# EAGLE design Gator-Tiara (EAGLE 6.4)
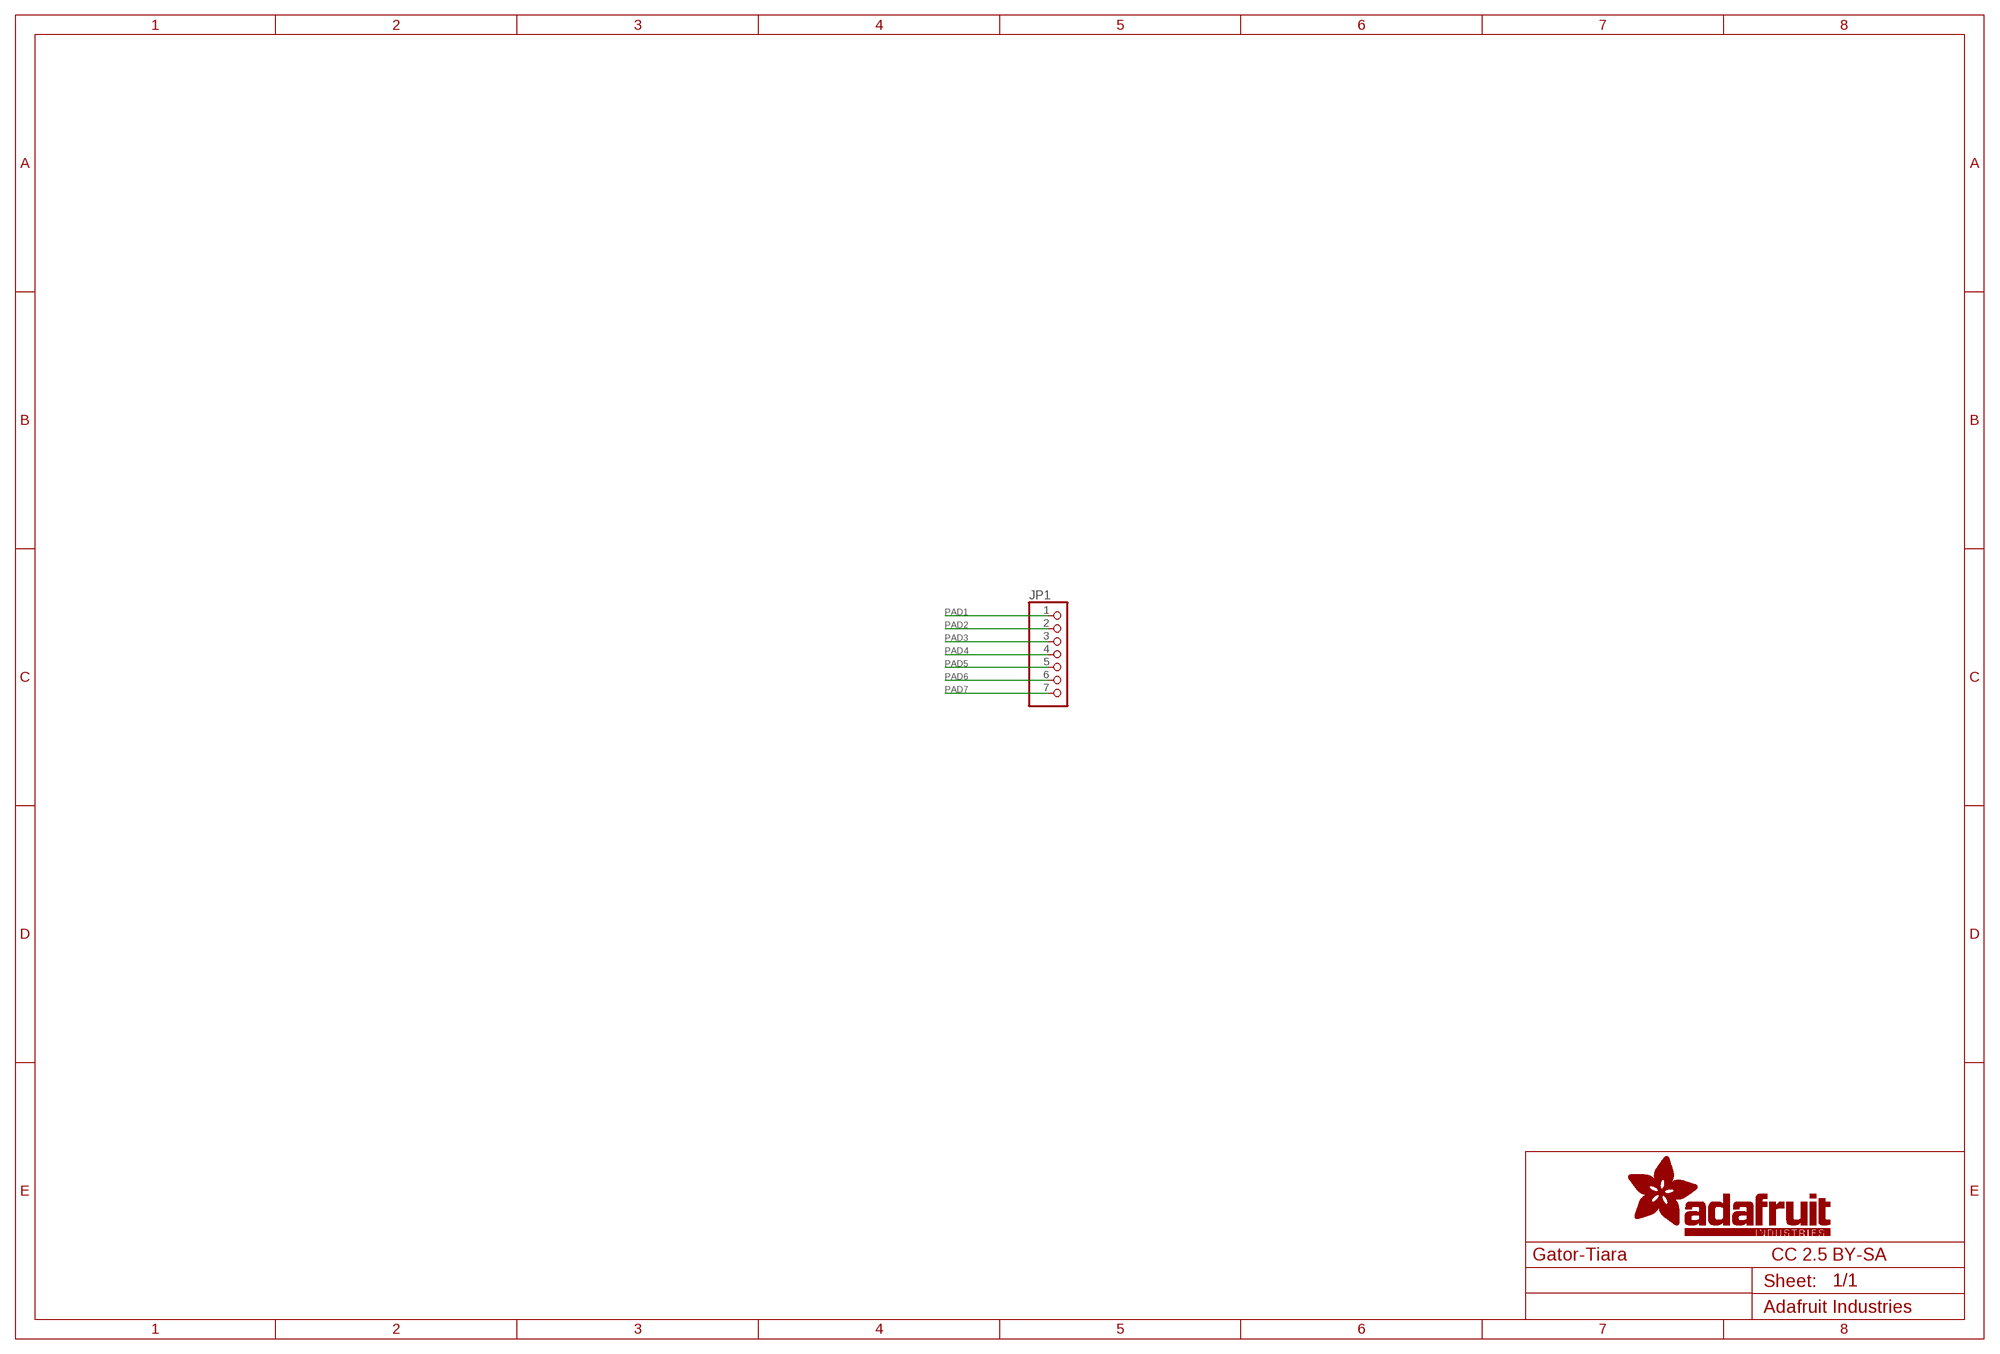
[diagram p0: schematic, sheet 1]

## Parts
JP1  PINHD-1X7/90  [1X07/90]
PAD1  SEWTAP-ALLIGATOR  [SEWALLI]
PAD2  SEWTAP-ALLIGATOR  [SEWALLI]
PAD3  SEWTAP-ALLIGATOR  [SEWALLI]
PAD4  SEWTAP-ALLIGATOR  [SEWALLI]
PAD5  SEWTAP-ALLIGATOR  [SEWALLI]
PAD6  SEWTAP-ALLIGATOR  [SEWALLI]
PAD7  SEWTAP-ALLIGATOR  [SEWALLI]

## Nets
N$1: JP1.1 PAD1.P$1(SEW)
N$2: JP1.2 PAD2.P$1(SEW)
N$3: JP1.3 PAD3.P$1(SEW)
N$4: JP1.4 PAD4.P$1(SEW)
N$5: JP1.5 PAD5.P$1(SEW)
N$6: JP1.6 PAD6.P$1(SEW)
N$7: JP1.7 PAD7.P$1(SEW)

## Notes on the sheet
- CC 2.5 BY-SA

## Library data of the parts
JP1 = pinhead:PINHD-1X7: PIN HEADER
PAD1-PAD7 = microbuilder:SEWTAP

## Board
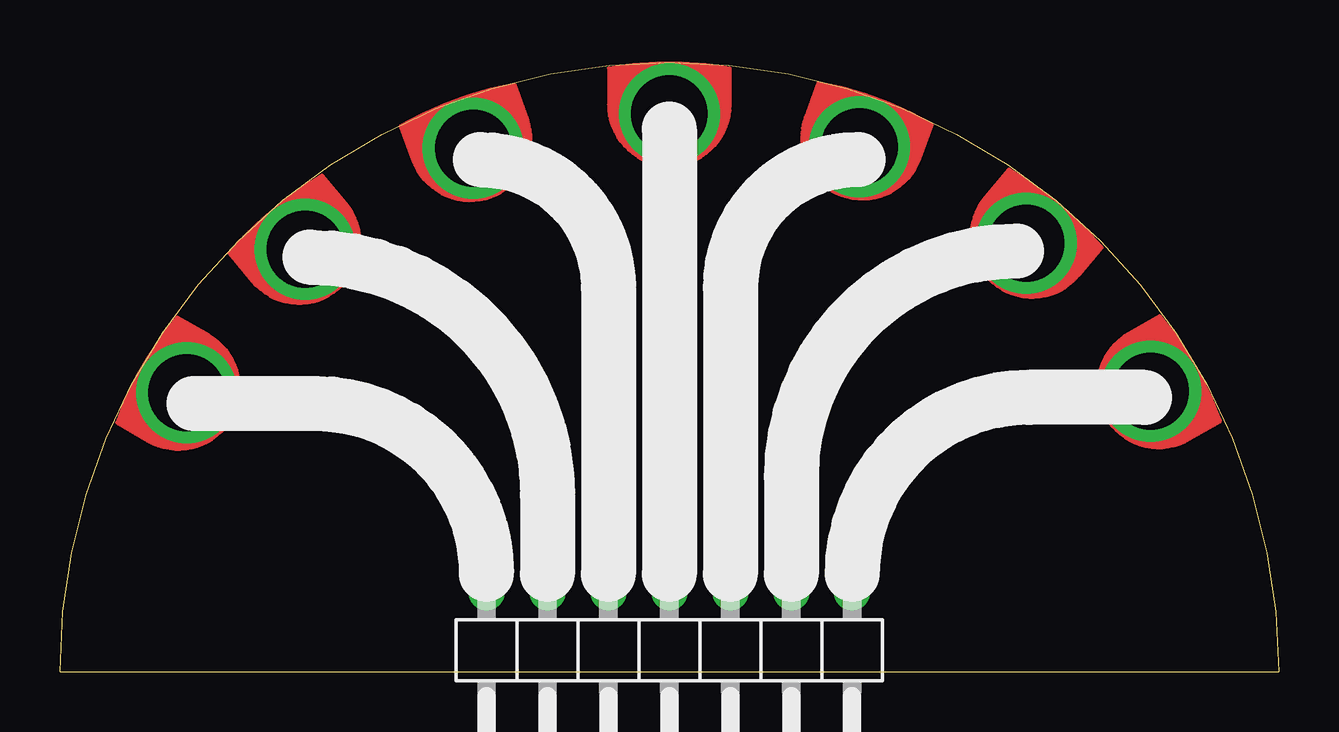
[diagram p1: board, top side]
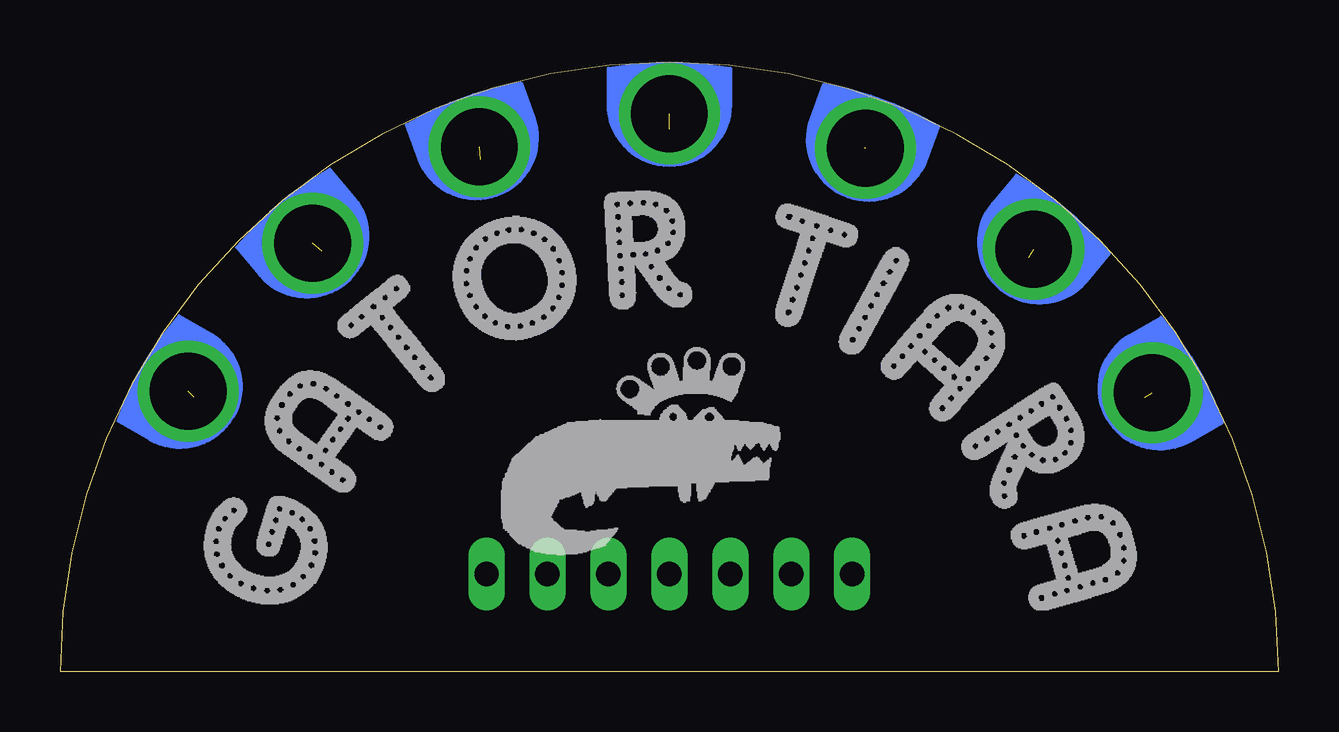
[diagram p2: board, bottom side, seen from below]

Size 50.8 x 25.4 mm. Coordinates in mm from the lower left corner, seen from the top.
Outline: 0,0 arc-180 50.8,0 0,0
Copper layers (1*16): Top 0.0356mm / dielectric 1.5011mm / Bottom 0.0356mm
Design rules "LaenPCBOrder": minimum track width 6mil, minimum drill 13mil, track to track 6mil, track to pad 6mil, pad to pad 6mil, via to via 6mil, smd to smd 6mil, copper to edge 15mil, drill to drill 6mil, minimum pad ring 7mil, minimum via ring 7mil, stop-mask expansion 4mil, vias tented up to drill 0mil, thermal gap 10mil

### Footprints (pad centres in the part's own frame; a part is rotated, then mirrored left to right if it is on the bottom)
1X07/90 = drill 1.016 long: 1 -7.62,-3.81; 2 -5.08,-3.81; 3 -2.54,-3.81; 4 0,-3.81; 5 2.54,-3.81; 6 5.08,-3.81; 7 7.62,-3.81
SEWALLI = drill 3.2: P$1 0,0.508

### Placement (x,y rotation side)
JP1  25.4,0.25 180 top
PAD1  45.02,11.43 300 top
PAD2  39.94,17.46 320 top
PAD3  33.15,21.4 340 top
PAD4  25.4,22.73 0 top
PAD5  17.4,21.34 20 top
PAD6  10.54,17.21 40 top
PAD7  5.71,11.37 60 top

### Tracks (layer width: path | path; a pad name or v marks a point on that pad's centre or on a via)
N$1  (1 unrouted)
  Top 1.016: 45.21,11.43 40.39,11.43 arc90 JP1.1
N$2  (1 unrouted)
  Top 1.016: 39.88,17.53 arc90 30.48,8.13 JP1.2
N$3  (1 unrouted)
  Top 1.016: 33.27,21.34 arc90 27.94,16 JP1.3
N$4  (1 unrouted)
  Top 1.016: 25.4,22.61 JP1.4
N$5  (1 unrouted)
  Top 1.016: 17.27,21.84 arc-90 22.86,16.26 JP1.5
N$6  (1 unrouted)
  Top 1.016: 10.41,17.27 arc-90 20.32,7.37 JP1.6
N$7  (1 unrouted)
  Top 1.016: 5.59,11.43 10.41,11.43 arc-90 JP1.7